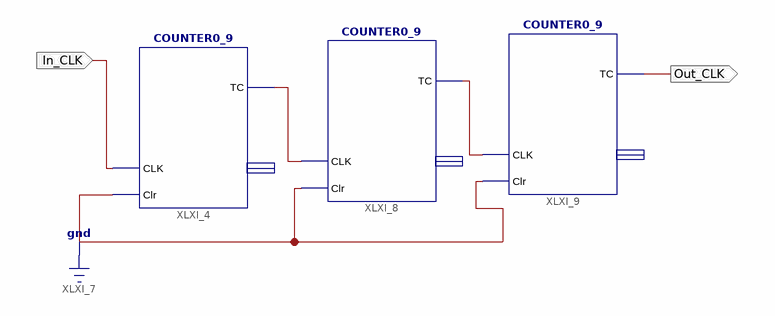
[diagram p0: schematic sheet 1]
// Xilinx ISE schematic Div1k.sch (spartan6) as structural Verilog: 3 symbols, 2 ports
module Div1k (
  input  In_CLK,
  output Out_CLK
);

  wire XLXN_2, XLXN_4;

  COUNTER0_9 XLXI_4 (.CLK(In_CLK), .Clr(1'b0), .TC(XLXN_4));  // open: bit
  COUNTER0_9 XLXI_8 (.CLK(XLXN_4), .Clr(1'b0), .TC(XLXN_2));  // open: bit
  COUNTER0_9 XLXI_9 (.CLK(XLXN_2), .Clr(1'b0), .TC(Out_CLK));  // open: bit
endmodule
